# Altium project ay_and_dac_vm1.PrjPcb
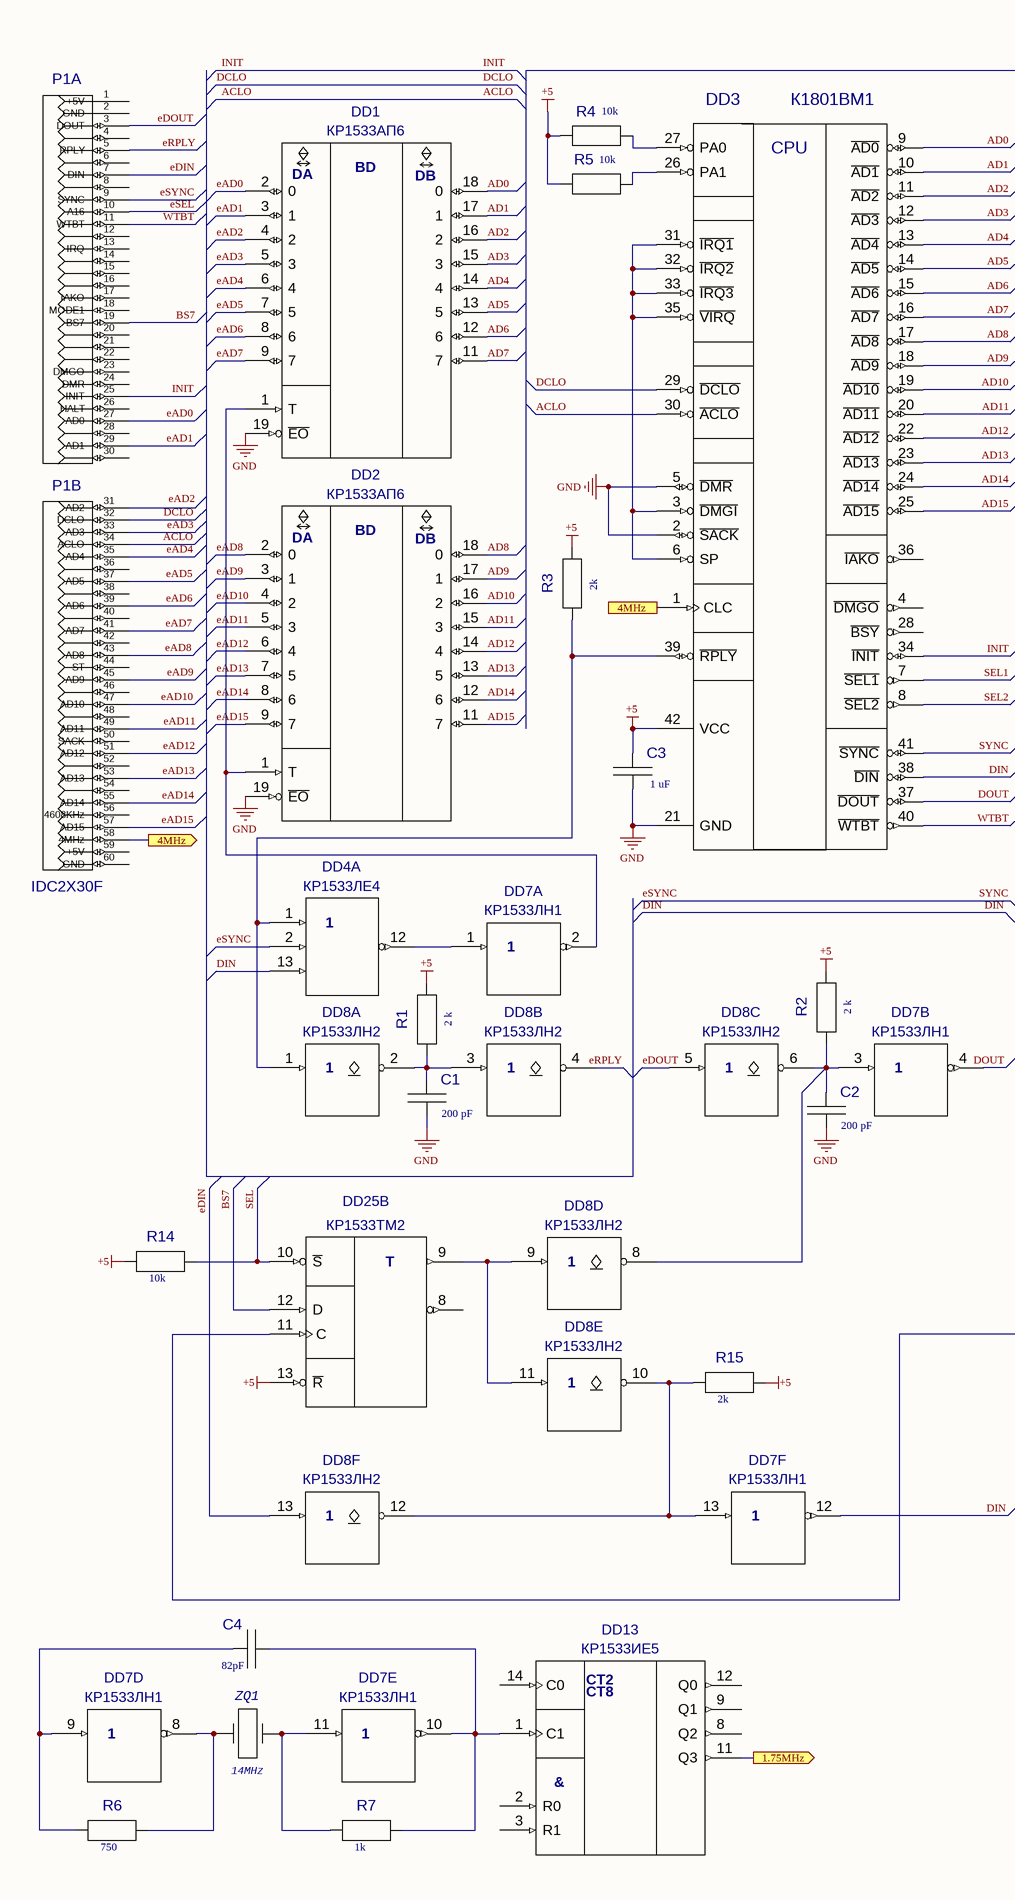
[diagram p0: ay_and_dac_vm1.SchDoc, left]
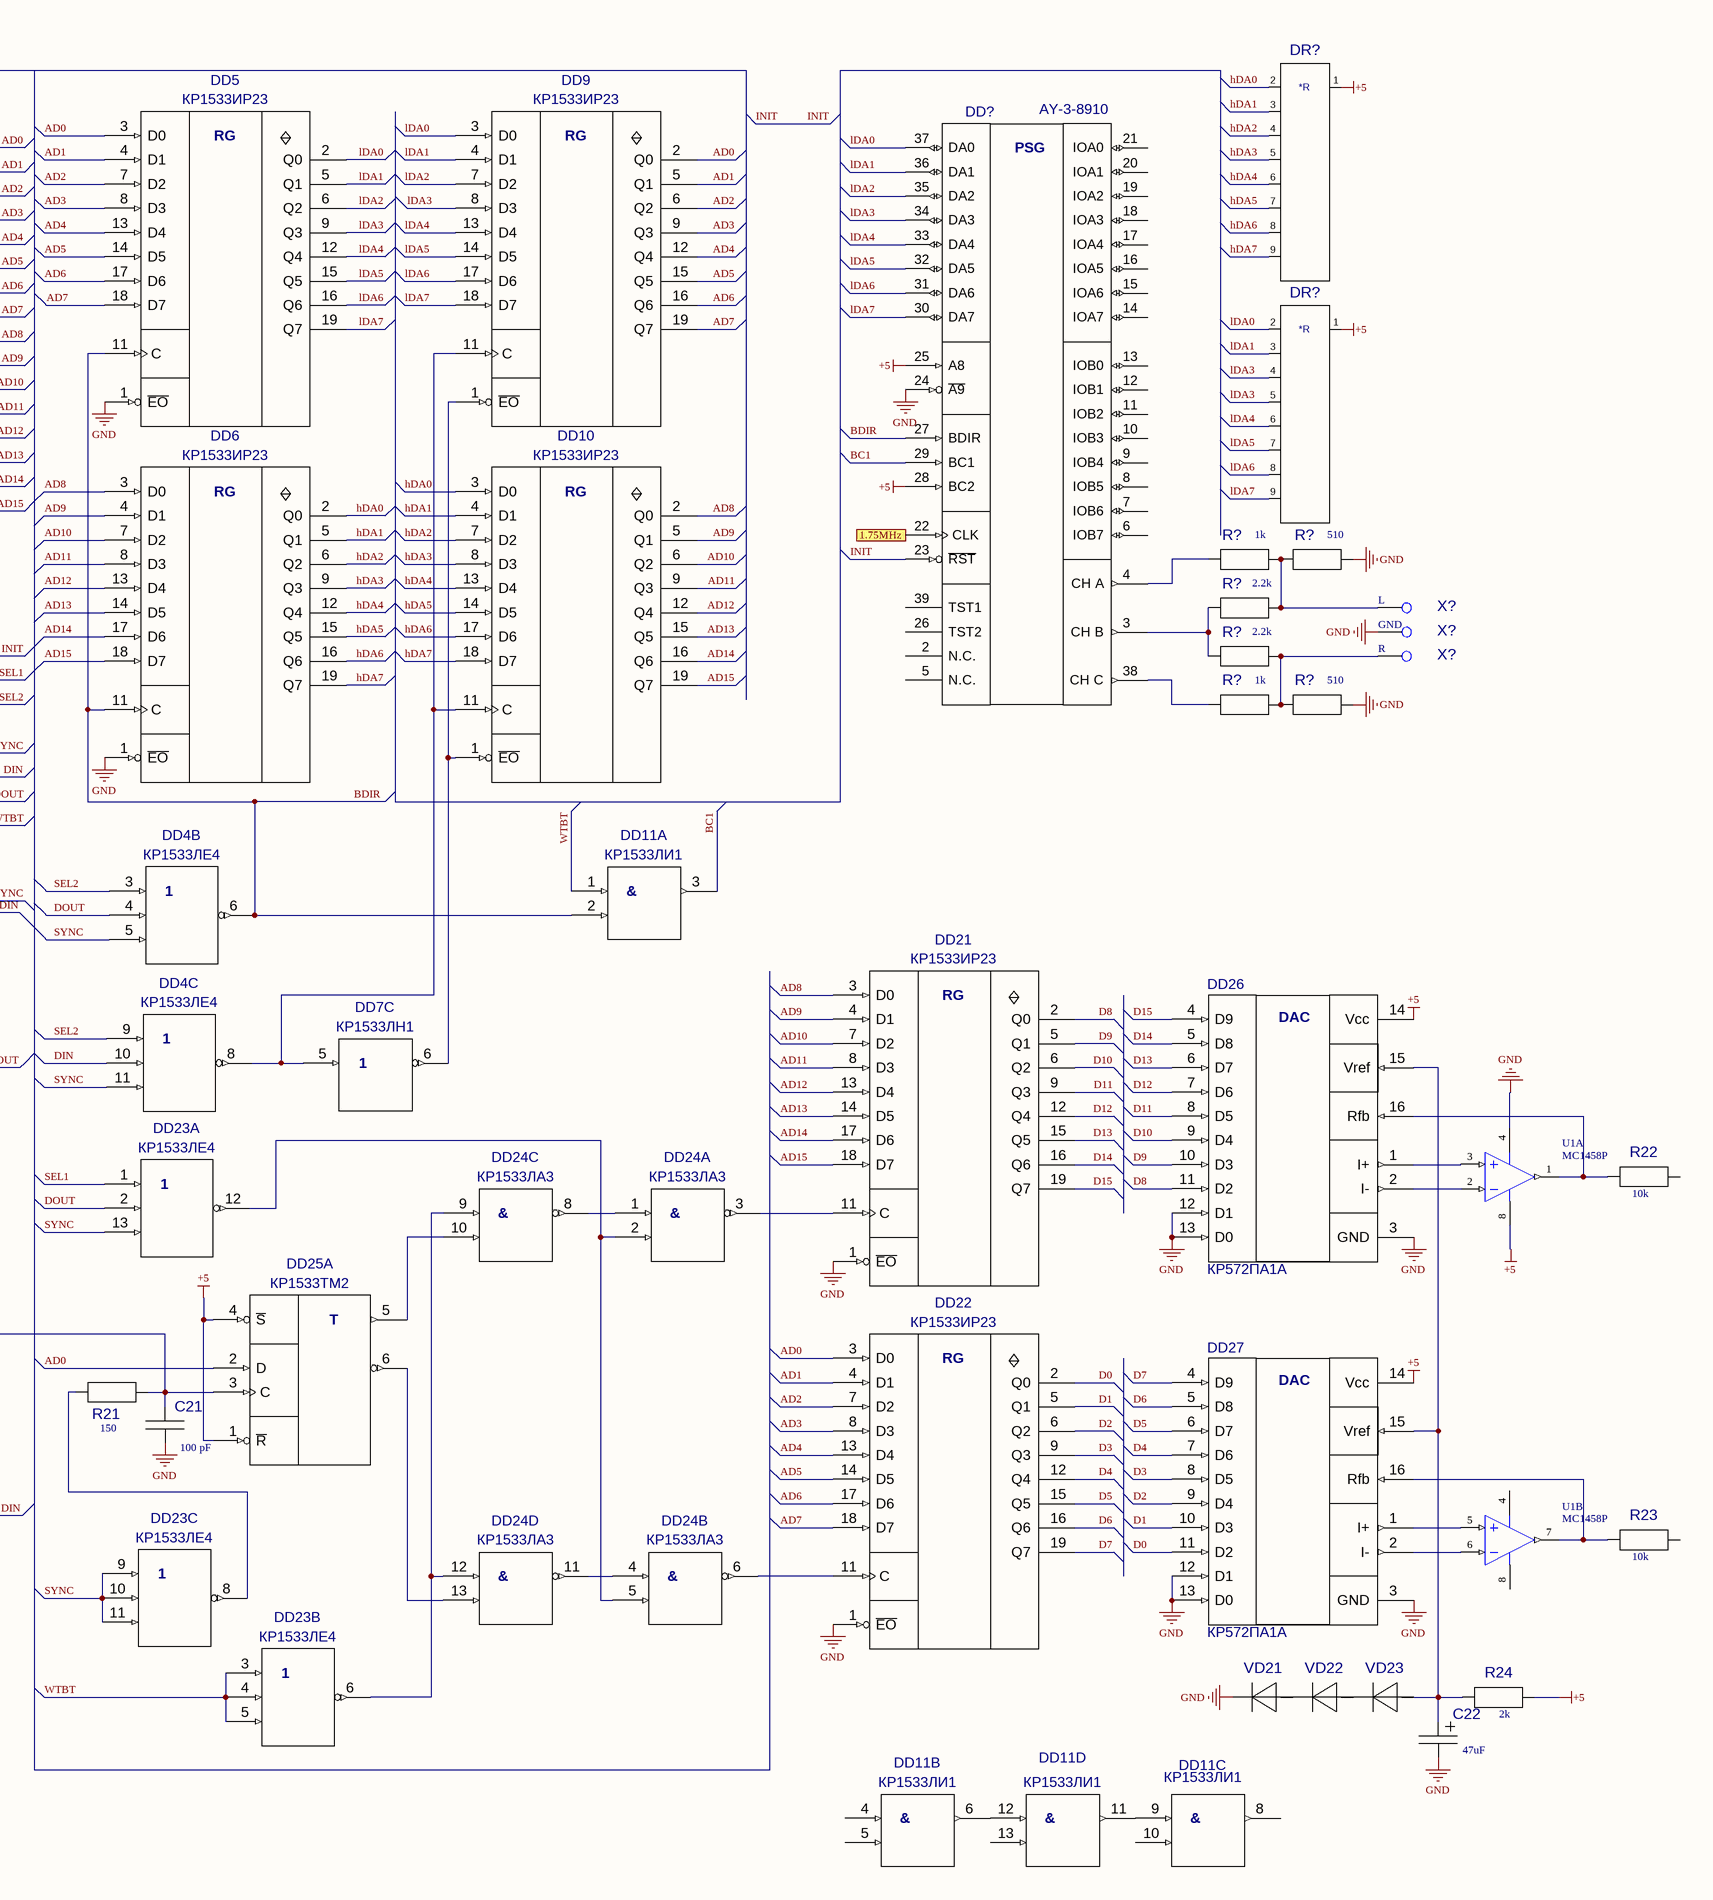
[diagram p1: ay_and_dac_vm1.SchDoc, right]
1 sheet, 56 parts. Net scope: flat (ports and power ports of the same name join across sheets).
Board file: ay_and_dac_vm1.PcbDoc

## Sheet ay_and_dac_vm1.SchDoc
size A2

### Parts
(Parts that share a designator on the sheet are numbered #1, #2 ... from top to bottom, then left to right.)
C1  value 200 pF  [K1017-1_K1017-1A]  (hidden comment: K1017-1)
C2  value 200 pF  [K1017-1_K1017-1A]  (hidden comment: K1017-1)
C3  value 1 uF  [K1017-1_K1017-1A]  (hidden comment: K1017-1)
C4  value 82pF  [K1017A]  (hidden comment: K1017A)
C21  value 100 pF  [K1017-1_K1017-1A]  (hidden comment: K1017-1)
C22  value 47uF  [ECR-8]  (hidden comment: ECR-8)
DD1  КР1533АП6  [2140.20-4]
DD2  КР1533АП6  [2140.20-4]
DD3  К1801ВМ1  [429-42]
DD4  КР1533ЛЕ4  [2101.14-1]  (parts A,B,C of 3)
DD5  КР1533ИР23  [2140.20-4]
DD6  КР1533ИР23  [2140.20-4]
DD7  КР1533ЛН1  [2101.14-1]  (parts A,B,C,D,E,F of 6)
DD8  КР1533ЛН2  [2101.14-1]  (parts A,B,C,D,E,F of 6)
DD9  КР1533ИР23  [2140.20-4]
DD10  КР1533ИР23  [2140.20-4]
DD11  КР1533ЛИ1  [2101.14-1]  (parts A,B,C,D of 4)
DD13  КР1533ИЕ5  [2101.14-1]
DD21  КР1533ИР23  [2140.20-4]
DD22  КР1533ИР23  [2140.20-4]
DD23  КР1533ЛЕ4  [2101.14-1]  (parts A,B,C of 3)
DD24  КР1533ЛА3  [2101.14-1]  (parts A,B,C,D of 4)
DD25  КР1533ТМ2  [2101.14-1]  (parts A,B of 2)
DD26  КР572ПА1А  [DIP16-3]
DD27  КР572ПА1А  [DIP16-3]
DD?  AY-3-8910  [DIP40]
DR?#1  NR1-4-8M  [NR1-4-8M]  (value not drawn)
DR?#2  NR1-4-8M  [NR1-4-8M]  (value not drawn)
P1  IDC2X30F  [IDC60F]  (value not drawn)  (parts A,B of 2)
R1  value 2 k  [R0125_Primary]  (hidden comment: R0125)
R2  value 2 k  [R0125_Primary]  (hidden comment: R0125)
R3  value 2k  [R0125_Primary]  (hidden comment: R0125)
R4  value 10k  [R0125_Primary]  (hidden comment: R0125)
R5  value 10k  [R0125_Primary]  (hidden comment: R0125)
R6  value 750  [R0125_Primary]  (hidden comment: R0125)
R7  value 1k  [R0125_Primary]  (hidden comment: R0125)
R14  value 10k  [R0125_Primary]  (hidden comment: R0125)
R15  value 2k  [R0125_Primary]  (hidden comment: R0125)
R21  value 150  [R0125_Primary]  (hidden comment: R0125)
R22  value 10k  [R0125_Primary]  (hidden comment: R0125)
R23  value 10k  [R0125_Primary]  (hidden comment: R0125)
R24  value 2k  [R0125_Primary]  (hidden comment: R0125)
R?#1  value 1k  [R0125_Primary]  (hidden comment: R0125)
R?#2  value 510  [R0125_Primary]  (hidden comment: R0125)
R?#3  value 2.2k  [R0125_Primary]  (hidden comment: R0125)
R?#4  value 2.2k  [R0125_Primary]  (hidden comment: R0125)
R?#5  value 1k  [R0125_Primary]  (hidden comment: R0125)
R?#6  value 510  [R0125_Primary]  (hidden comment: R0125)
U1  MC1458P  [TI-P8]  (parts A,B of 2)
VD21  KD522  [VDD10_12.5mm]  (value not drawn)
VD22  KD522  [VDD10_12.5mm]  (value not drawn)
VD23  KD522  [VDD10_12.5mm]  (value not drawn)
X?#1  value L  [KONT-2]  (hidden comment: KONT-2,5)
X?#2  value GND  [KONT-2]  (hidden comment: KONT-2,5)
X?#3  value R  [KONT-2]  (hidden comment: KONT-2,5)
ZQ1  value 14MHz  [МА_РК8(Primary)]  (hidden comment: РК8)

### Ports
1.75MHz (in), 1.75MHz (out), 4MHz (in), 4MHz (out)

### Nets
+5: C3.1(I/OA) DD3.42(VCC) DD25.1(~{R}) DD25.4(~{S}) DD25.13(~{R}) DD26.14(Vcc) DD27.14(Vcc) DD?.25(A8) DD?.28(BC2) DR?#1.1(I/O1) DR?#2.1(I/O1) R1.2(I/OB) R2.2(I/OB) R3.2(I/OB) R4.1(I/OA) R5.1(I/OA) R14.1(I/OA) R15.2(I/OB) R24.2(I/OB) U1.8(VCC+)
GND: C1.2(I/OB) C2.2(I/OB) C3.2(I/OB) C21.2(I/OB) C22.2(I/OB) DD1.19(~{EO}) DD2.19(~{EO}) DD3.2(~{SACK}) DD3.5(~{DMR}) DD3.21(GND) DD5.1(~{EO}) DD6.1(~{EO}) DD21.1(~{EO}) DD22.1(~{EO}) DD26.3(GND) DD26.12(D1) DD26.13(D0) DD27.3(GND) DD27.12(D1) DD27.13(D0) DD?.24(~{A9}) R?#2.2(I/OB) R?#6.2(I/OB) U1.4(VCC-) VD21.1(I/O1) X?#2.1(I/O)
ACLO: DD3.30(~{ACLO}) P1.34(ACLO)
AD0: DD1.18(0) DD3.9(~{AD0}) DD5.3(D0) DD9.2(Q0) DD22.3(D0) DD25.2(D)
AD1: DD1.17(1) DD3.10(~{AD1}) DD5.4(D1) DD9.5(Q1) DD22.4(D1)
AD2: DD1.16(2) DD3.11(~{AD2}) DD5.7(D2) DD9.6(Q2) DD22.7(D2)
AD3: DD1.15(3) DD3.12(~{AD3}) DD5.8(D3) DD9.9(Q3) DD22.8(D3)
AD4: DD1.14(4) DD3.13(~{AD4}) DD5.13(D4) DD9.12(Q4) DD22.13(D4)
AD5: DD1.13(5) DD3.14(~{AD5}) DD5.14(D5) DD9.15(Q5) DD22.14(D5)
AD6: DD1.12(6) DD3.15(~{AD6}) DD5.17(D6) DD9.16(Q6) DD22.17(D6)
AD7: DD1.11(7) DD3.16(~{AD7}) DD5.18(D7) DD9.19(Q7) DD22.18(D7)
AD8: DD2.18(0) DD3.17(~{AD8}) DD6.3(D0) DD10.2(Q0) DD21.3(D0)
AD9: DD2.17(1) DD3.18(~{AD9}) DD6.4(D1) DD10.5(Q1) DD21.4(D1)
AD10: DD2.16(2) DD3.19(~{AD10}) DD6.7(D2) DD10.6(Q2) DD21.7(D2)
AD11: DD2.15(3) DD3.20(~{AD11}) DD6.8(D3) DD10.9(Q3) DD21.8(D3)
AD12: DD2.14(4) DD3.22(~{AD12}) DD6.13(D4) DD10.12(Q4) DD21.13(D4)
AD13: DD2.13(5) DD3.23(~{AD13}) DD6.14(D5) DD10.15(Q5) DD21.14(D5)
AD14: DD2.12(6) DD3.24(~{AD14}) DD6.17(D6) DD10.16(Q6) DD21.17(D6)
AD15: DD2.11(7) DD3.25(~{AD15}) DD6.18(D7) DD10.19(Q7) DD21.18(D7)
BC1: DD11.3 DD?.29(BC1)
BDIR: DD4.6 DD5.11(C) DD6.11(C) DD11.2 DD?.27(BDIR)
BS7: DD25.12(D) P1.19(BS7)
D0: DD22.2(Q0) DD27.11(D2)
D1: DD22.5(Q1) DD27.10(D3)
D2: DD22.6(Q2) DD27.9(D4)
D3: DD22.9(Q3) DD27.8(D5)
D4: DD22.12(Q4) DD27.7(D6)
D5: DD22.15(Q5) DD27.6(D7)
D6: DD22.16(Q6) DD27.5(D8)
D7: DD22.19(Q7) DD27.4(D9)
D8: DD21.2(Q0) DD26.11(D2)
D9: DD21.5(Q1) DD26.10(D3)
D10: DD21.6(Q2) DD26.9(D4)
D11: DD21.9(Q3) DD26.8(D5)
D12: DD21.12(Q4) DD26.7(D6)
D13: DD21.15(Q5) DD26.6(D7)
D14: DD21.16(Q6) DD26.5(D8)
D15: DD21.19(Q7) DD26.4(D9)
DCLO: DD3.29(~{DCLO}) P1.32(DCLO)
DIN: DD3.38(~{DIN}) DD4.10 DD4.13 DD7.12
DOUT: DD3.37(~{DOUT}) DD4.4 DD7.4 DD23.2
eAD0: DD1.2(0) P1.27(AD0)
eAD1: DD1.3(1) P1.29(AD1)
eAD2: DD1.4(2) P1.31(AD2)
eAD3: DD1.5(3) P1.33(AD3)
eAD4: DD1.6(4) P1.35(AD4)
eAD5: DD1.7(5) P1.37(AD5)
eAD6: DD1.8(6) P1.39(AD6)
eAD7: DD1.9(7) P1.41(AD7)
eAD8: DD2.2(0) P1.43(AD8)
eAD9: DD2.3(1) P1.45(AD9)
eAD10: DD2.4(2) P1.47(AD10)
eAD11: DD2.5(3) P1.49(AD11)
eAD12: DD2.6(4) P1.51(AD12)
eAD13: DD2.7(5) P1.53(AD13)
eAD14: DD2.8(6) P1.55(AD14)
eAD15: DD2.9(7) P1.57(AD15)
eDIN: DD8.13 P1.7(DIN)
eDOUT: DD8.5 P1.3(DOUT)
eRPLY: DD8.4 P1.5(RPLY)
eSEL: P1.10(A16)
eSYNC: DD3.41(~{SYNC}) DD4.2 DD4.5 DD4.11 DD23.9 DD23.10 DD23.11 DD23.13 P1.9(SYNC)  [also labelled SYNC]
hDA0: DD6.2(Q0) DD10.3(D0) DR?#1.2(I/O2)
hDA1: DD6.5(Q1) DD10.4(D1) DR?#1.3(I/O3)
hDA2: DD6.6(Q2) DD10.7(D2) DR?#1.4(I/O4)
hDA3: DD6.9(Q3) DD10.8(D3) DR?#1.5(I/O5)
hDA4: DD6.12(Q4) DD10.13(D4) DR?#1.6(I/O6)
hDA5: DD6.15(Q5) DD10.14(D5) DR?#1.7(I/O7)
hDA6: DD6.16(Q6) DD10.17(D6) DR?#1.8(I/O8)
hDA7: DD6.19(Q7) DD10.18(D7) DR?#1.9(I/O9)
INIT: DD3.34(~{INIT}) DD?.23(~{RST}) P1.25(INIT)
lDA0: DD5.2(Q0) DD9.3(D0) DD?.37(DA0) DR?#2.2(I/O2)
lDA1: DD5.5(Q1) DD9.4(D1) DD?.36(DA1) DR?#2.3(I/O3)
lDA2: DD5.6(Q2) DD9.7(D2) DD?.35(DA2)
lDA3: DD5.9(Q3) DD9.8(D3) DD?.34(DA3) DR?#2.4(I/O4) DR?#2.5(I/O5)
lDA4: DD5.12(Q4) DD9.13(D4) DD?.33(DA4) DR?#2.6(I/O6)
lDA5: DD5.15(Q5) DD9.14(D5) DD?.32(DA5) DR?#2.7(I/O7)
lDA6: DD5.16(Q6) DD9.17(D6) DD?.31(DA6) DR?#2.8(I/O8)
lDA7: DD5.19(Q7) DD9.18(D7) DD?.30(DA7) DR?#2.9(I/O9)
SEL: DD25.10(~{S}) R14.2(I/OB)
SEL1: DD3.7(~{SEL1}) DD23.1
SEL2: DD3.8(~{SEL2}) DD4.3 DD4.9
WTBT: DD3.40(~{WTBT}) DD11.1 DD23.3 DD23.4 DD23.5 P1.11(WTBT)
NetC1_1: C1.1(I/OA) DD8.2 DD8.3 R1.1(I/OA)
NetC2_1: C2.1(I/OA) DD7.3 DD8.6 DD8.8 R2.1(I/OA)
NetC4_1: C4.1(i/o) DD7.9 R6.1(I/OA)
NetC4_2: C4.2(i/o1) DD7.10 DD13.1(C1) R7.2(I/OB)
NetC21_1: C21.1(I/OA) DD25.3(C) DD25.11(C) R21.2(I/OB)
NetC22_1: C22.1(I/OA) DD26.15(Vref) DD27.15(Vref) R24.1(I/OA) VD23.2(I/O2)
NetDD1_1: DD1.1(T) DD2.1(T) DD7.2
NetDD3_1: DD3.1(CLC) P1.58(4MHz) ; port 4MHz
NetDD3_3: DD3.3(~{DMGI}) DD3.6(SP) DD3.31(~{IRQ1}) DD3.32(~{IRQ2}) DD3.33(~{IRQ3}) DD3.35(~{VIRQ})
NetDD3_26: DD3.26(PA1) R5.2(I/OB)
NetDD3_27: DD3.27(PA0) R4.2(I/OB)
NetDD3_39: DD3.39(~{RPLY}) DD4.1 DD8.1 R3.1(I/OA)
NetDD4_8: DD4.8 DD7.5 DD9.11(C) DD10.11(C)
NetDD4_12: DD4.12 DD7.1
NetDD7_6: DD7.6 DD9.1(~{EO}) DD10.1(~{EO})
NetDD7_8: DD7.8 R6.2(I/OB) ZQ1.B
NetDD7_11: DD7.11 R7.1(I/OA) ZQ1.A
NetDD7_13: DD7.13 DD8.10 DD8.12 R15.1(I/OA)
NetDD8_9: DD8.9 DD8.11 DD25.9
NetDD11_6: DD11.6 DD11.12
NetDD11_9: DD11.9 DD11.11
NetDD13_11: DD13.11(Q3) DD?.22(CLK) ; port 1.75MHz
NetDD21_11: DD21.11(C) DD24.3
NetDD22_11: DD22.11(C) DD24.6
NetDD23_6: DD23.6 DD24.9 DD24.12
NetDD23_8: DD23.8 R21.1(I/OA)
NetDD23_12: DD23.12 DD24.2 DD24.5
NetDD24_1: DD24.1 DD24.8
NetDD24_4: DD24.4 DD24.11
NetDD24_10: DD24.10 DD25.5
NetDD24_13: DD24.13 DD25.6
NetDD26_1: DD26.1(I+) U1.3(IN1+)
NetDD26_2: DD26.2(I-) U1.2(IN1-)
NetDD26_16: DD26.16(Rfb) R22.1(I/OA) U1.1(OUT1)
NetDD27_1: DD27.1(I+) U1.5(IN2+)
NetDD27_2: DD27.2(I-) U1.6(IN2-)
NetDD27_16: DD27.16(Rfb) R23.1(I/OA) U1.7(OUT2)
NetDD?_3: DD?.3(CH_B) R?#3.1(I/OA) R?#4.1(I/OA)
NetDD?_4: DD?.4(CH_A) R?#1.1(I/OA)
NetDD?_38: DD?.38(CH_C) R?#5.1(I/OA)
NetR?#1_2: R?#1.2(I/OB) R?#2.1(I/OA) R?#3.2(I/OB) X?#1.1(I/O)
NetR?#4_2: R?#4.2(I/OB) R?#5.2(I/OB) R?#6.1(I/OA) X?#3.1(I/O)
NetVD21_2: VD21.2(I/O2) VD22.1(I/O1)
NetVD22_2: VD22.2(I/O2) VD23.1(I/O1)

Not connected (* = marked no-connect by the designer): DD1 10(GND) 20(+5V); DD2 10(GND) 20(+5V); DD3 4(~{DMGO}) 28(~{BSY}) 36(~{IAKO}); DD4 7(GND) 14(+5V); DD5 10(GND) 20(+5V); DD6 10(GND) 20(+5V); DD7 7(GND) 14(+5V); DD8 7(GND) 14(+5V); DD9 10(GND) 20(+5V); DD10 10(GND) 20(+5V); DD11 4 5 7(GND) 8 10 13 14(+5V); DD13 2(R0) 3(R1) 4 5(+5V) 6 7 8(Q2) 9(Q1) 10(GND) 12(Q0) 13 14(C0); DD21 10(GND) 20(+5V); DD22 10(GND) 20(+5V); DD23 7(GND) 14(+5V); DD24 7(GND) 14(+5V); DD25 7(GND) 8 14(+5V); DD? 1(Vss) 2(N.C.) 5(N.C.) 6(IOB7) 7(IOB6) 8(IOB5) 9(IOB4) 10(IOB3) 11(IOB2) 12(IOB1) 13(IOB0) 14(IOA7) 15(IOA6) 16(IOA5) 17(IOA4) 18(IOA3) 19(IOA2) 20(IOA1) 21(IOA0) 26(TST2) 39(TST1) 40(Vcc); P1 1(+5V) 2(GND) 4 6 8 12 13(IRQ) 14 15 16 17(IAKO) 18(MODE1) 20 21 22 23(DMGO) 24(DMR) 26(HALT) 28 30 36 38 40 42 44(ST) 46 48 50(SACK) 52 54 56(4608KHz) 59(+5V) 60(GND); R22 2(I/OB); R23 2(I/OB)

### Notes on the sheet
- (in symbol AY-3-8910) PSG
- (in symbol K1801VM1) CPU
- (in symbol NR1-4-8M) *R
- (in symbol КР572ПА1) DAC
- (in symbol КР1533АП6) BD; DA; DB
- (in symbol КР1533ИЕ5) CT2; CT8; &
- (in symbol КР1533ИР23) RG
- (in symbol КР1533ЛА3, part A) &
- (in symbol КР1533ЛА3, part B) &
- (in symbol КР1533ЛА3, part C) &
- (in symbol КР1533ЛА3, part D) &
- (in symbol КР1533ЛИ1, part A) &
- (in symbol КР1533ЛИ1, part B) &
- (in symbol КР1533ЛИ1, part C) &
- (in symbol КР1533ЛИ1, part D) &
- (in symbol КР1533ТМ2, part A) T
- (in symbol КР1533ТМ2, part B) T

### Library data of the parts
C1-C3 C21 = K1017-1: PDIF_TY: 11213
DD3 = K1801VM1: Value: *
DD26 DD27 = КР572ПА1
P1 = IDC2X30F: IDC Header; Value: *
R1-R7 R14 R15 R21-R24 R?#1-R?#6 = R0125: PDIF_TY: 11107
U1 = MC1458P: Dual General-Purpose Operational Amplifier, 10 to 30 V, 0 to 70 degC, 8-pin DIP (P8), Pb-Free (RoHS); Manufacturer: Texas Instruments; CMRR(Min)(dB): 70; GBW(Typ)(MHz): 1; IIB(Max)(pA): 500000; Iq per channel(Max)(mA): 2.8; Number of Channels: 2; Slew Rate(Typ)(V/us): 0.5; Sub Family: General Purpose Amplifier, High Supply Voltage Amplifier (>=30V); Total Supply Voltage(Max)(+5V is 5, +/-5V is 10): 30; Total Supply Voltage(Min)(+5V is 5, +/-5V is 10): 10; Vio (25C)(Max)(mV): 6; Vn at 1kHz(Typ)(nV/rtHz): 45; DatasheetVersion: SLOS069C; PackageVersion: 4040082/E, 04/2010; PackageReference: P8; PackageDescription: 8-Pin Plastic In-Line, Body 9.59 x 6.35 mm, Pitch 2.54 mm; Supplier 1: Digi-Key; Supplier Part Number 1: 296-1403-5-ND; Supplier 2: Farnell; Supplier Part Number 2: 1103044; Supplier 3: Newark; Supplier Part Number 3: 60K6206; Supplier 4: Mouser; Supplier Part Number 4: 595-MC1458P; Eco-Plan: Pb-Free (RoHS); Mounting Technology: Through Hole; Code_JEDEC: MS-001; PartNumber: MC1458P; ComponentLink1Description: Manufacturer URL; ComponentLink1URL: http://www.ti.com/; ComponentLink2Description: Datasheet; ComponentLink2URL: http://www.ti.com/lit/ds/symlink/mc1458.pdf; ComponentLink3Description: Package Specification; ComponentLink3URL: http://www.ti.com/litv/pdf/mpdi001b
ZQ1 = РК8: Capacitor
DD1 DD2 = КР1533АП6: Value: *
DD4 DD23 = КР1533ЛЕ4: Value: *
DD5 DD6 DD9 DD10 DD21 DD22 = КР1533ИР23: Value: *
DD7 = КР1533ЛН1: Value: *
DD8 = КР1533ЛН2: Value: *
DD11 = КР1533ЛИ1: Value: *
DD13 = КР1533ИЕ5: Value: *
DD24 = КР1533ЛА3: Value: *
DD25 = КР1533ТМ2: Value: *
DD? = AY-3-8910: Value: *
DR?#1 DR?#2 = NR1-4-8M: Value: *
VD21-VD23 = KD522: Value: *